# Altium schematic sheet PowerSupply.SchDoc
size A4; SheetNumber: 1; SheetTotal: 4
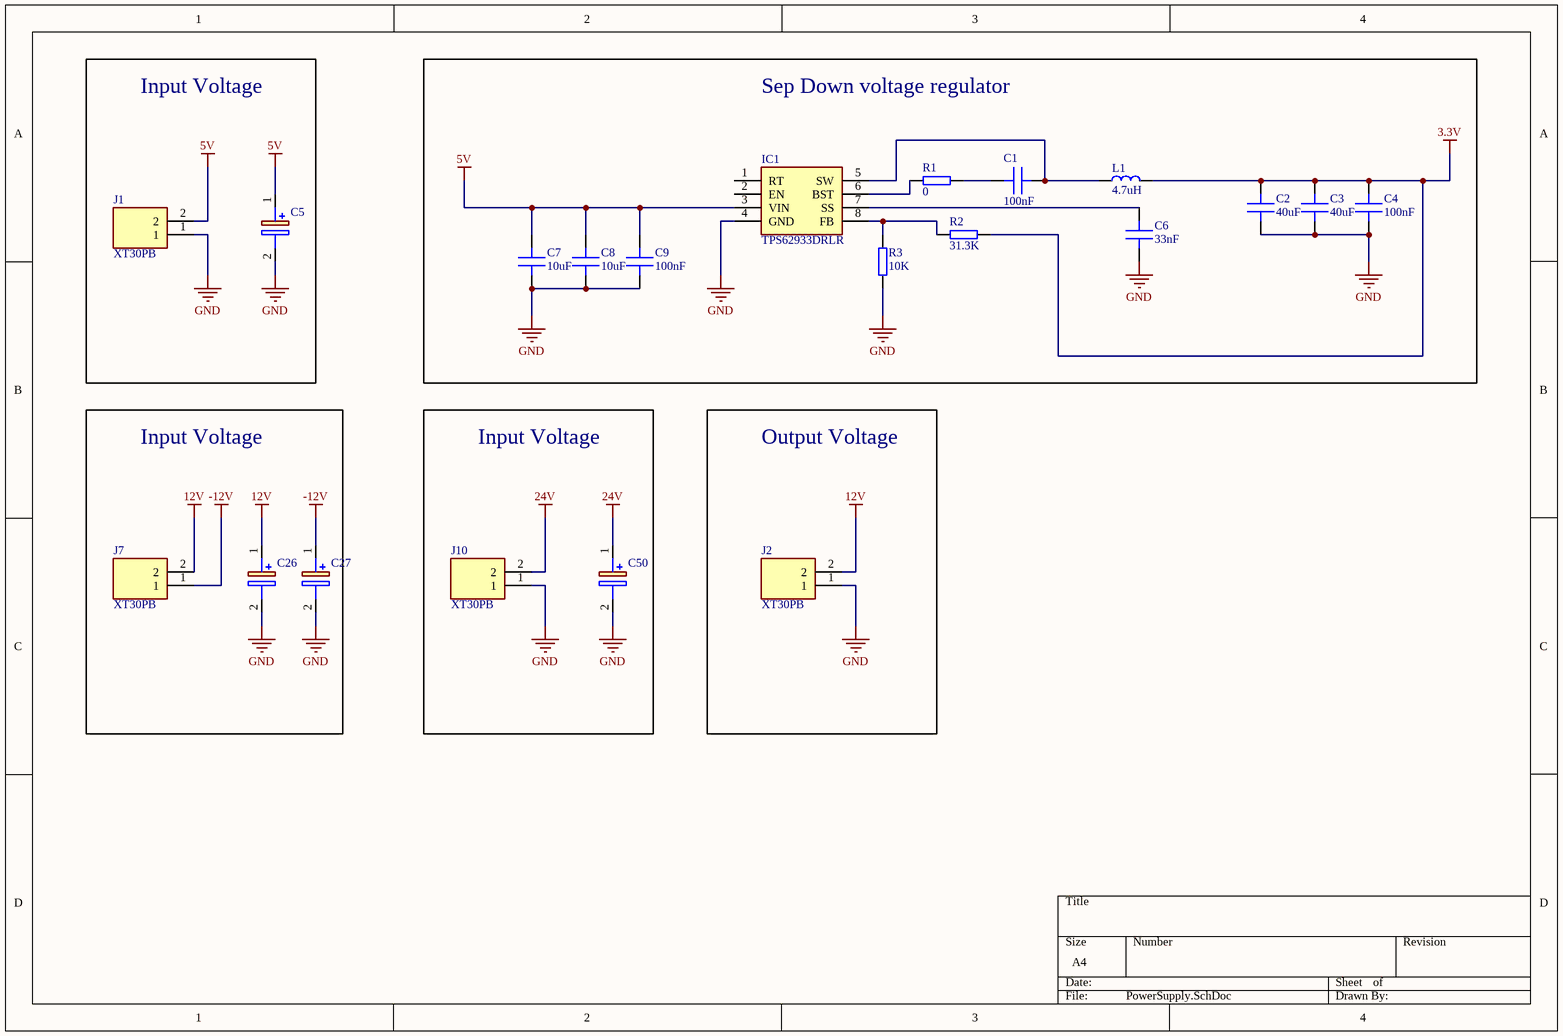
[diagram p0: PowerSupply.SchDoc]

## Parts
C1  100nF  [C 0402]
C2  40uF  [C 1206]
C3  40uF  [C 1206]
C4  100nF  [C 0603]
C5  UVY1V101MED1TD  [CAPPRD250W50D655H1250]  (value not drawn)
C6  33nF  [C 0402]
C7  10uF  [C 1206]
C8  10uF  [C 1206]
C9  100nF  [C 0603]
C26  UVY1V101MED1TD  [CAPPRD250W50D655H1250]  (value not drawn)
C27  UVY1V101MED1TD  [CAPPRD250W50D655H1250]  (value not drawn)
C50  UVY1V101MED1TD  [CAPPRD250W50D655H1250]  (value not drawn)
IC1  TPS62933DRLR  [SOTFL50P160X60-8N]
J1  XT30PB  [XT30PB]
J2  XT30PB  [XT30PB]
J7  XT30PB  [XT30PB]
J10  XT30PB  [XT30PB]
L1  4.7uH  [HPI0630]
R1  0  [R 0402]
R2  31.3K  [R 0402]
R3  10K  [R 0402]

## Blocks framed on the sheet
Input Voltage: C5 J1
Sep Down voltage regulator: C1-C4 C6-C9 IC1 L1 R1-R3
Input Voltage: C26 C27 J7
Input Voltage: C50 J10
Output Voltage: J2

## Nets
3.3V: C2.1 C3.1 C4.1 L1.2 R2.1
5V: C5.1(+) C7.1 C8.1 C9.1 IC1.3(VIN) J1.2
12V: C26.1(+) J2.2 J7.2
24V: C50.1(+) J10.2
-12V: C27.1(+) J7.1
GND: C2.2 C3.2 C4.2 C5.2(-) C6.2 C7.2 C8.2 C9.2 C26.2(-) C27.2(-) C50.2(-) IC1.4(GND) J1.1 J2.1 J10.1 R3.1
NetC1_1: C1.1 R1.1
NetC1_2: C1.2 IC1.5(SW) L1.1
NetC6_1: C6.1 IC1.7(SS)
NetIC1_6: IC1.6(BST) R1.2
NetIC1_8: IC1.8(FB) R2.2 R3.2

Not connected (* = marked no-connect by the designer): IC1 1(RT) 2(EN)

## Library data of the parts
C1-C4 C6-C9 = Capacitor: MLCC Capacitor
C5 C26 C27 C50 = UVY1V101MED1TD: Capacitor Polarised; Manufacturer_Name: Nichicon; Datasheet Link: http://nichicon-us.com/english/products/pdfs/e-uvy.pdf; Height: 12.5mm; Manufacturer_Part_Number: UVY1V101MED1TD; Arrow Part Number: UVY1V101MED1TD; Arrow Price/Stock: https://www.arrow.com/en/products/uvy1v101med1td/nichicon
IC1 = TPS62933DRLR: Integrated Circuit; Manufacturer_Name: Texas Instruments; Datasheet Link: https://www.ti.com/lit/ds/symlink/tps62933.pdf?ts=1626073394234; Height: 0.6mm; Manufacturer_Part_Number: TPS62933DRLR; Mouser Part Number: 595-TPS62933DRLR; Mouser Price/Stock: https://www.mouser.co.uk/ProductDetail/Texas-Instruments/TPS62933DRLR?qs=Rp5uXu7WBW9fv47wfQVntQ%3D%3D; Arrow Part Number: TPS62933DRLR; Arrow Price/Stock: https://www.arrow.com/en/products/tps62933drlr/texas-instruments?utm_currency=USD&region=nac
J1 J2 J7 J10 = XT30PB: Connector; Manufacturer_Name: Amass; Datasheet Link: https://www.tme.eu/Document/4acc913878197f8c2e30d4b8cdc47230/XT30UPB%20SPEC.pdf; Height: 10.7mm; Manufacturer_Part_Number: XT30PB
L1 = Inductor: General pourpouse inductor
R1-R3 = Resistor: General pourpouse resistor